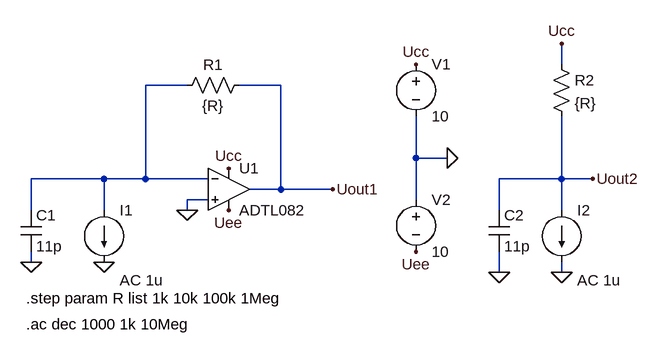
[diagram p0: schematic Zadanie2.asc]
Zadanie2.asc, the LTspice schematic file:
Version 4.1
SHEET 1 880 680
WIRE 416 -32 416 -64
WIRE -160 0 -224 0
WIRE -16 0 -80 0
WIRE 192 112 192 48
WIRE 240 112 192 112
WIRE -288 144 -400 144
WIRE -224 144 -224 0
WIRE -224 144 -288 144
WIRE -128 144 -224 144
WIRE 416 144 416 48
WIRE 416 144 320 144
WIRE 464 144 416 144
WIRE -16 160 -16 0
WIRE -16 160 -64 160
WIRE 64 160 -16 160
WIRE -128 176 -160 176
WIRE 192 176 192 112
WIRE -400 192 -400 144
WIRE -288 192 -288 144
WIRE -160 192 -160 176
WIRE 320 192 320 144
WIRE 416 192 416 144
WIRE -400 272 -400 256
WIRE 320 288 320 256
WIRE 416 288 416 272
FLAG -96 192 Uee
FLAG -96 128 Ucc
FLAG 64 160 Uout1
FLAG -160 192 0
FLAG -288 272 0
FLAG -400 272 0
FLAG 192 -32 Ucc
FLAG 192 256 Uee
FLAG 240 112 0
FLAG 320 288 0
FLAG 416 288 0
FLAG 416 -64 Ucc
FLAG 464 144 Uout2
SYMBOL OpAmps\\ADTL082 -96 96 R0
SYMATTR InstName U1
SYMBOL res -64 -16 R90
WINDOW 0 0 56 VBottom 2
WINDOW 3 32 56 VTop 2
SYMATTR InstName R1
SYMATTR Value {R}
SYMBOL current -288 192 R0
WINDOW 123 24 108 Left 2
WINDOW 39 0 0 Left 0
SYMATTR Value2 AC 1u
SYMATTR InstName I1
SYMATTR Value ""
SYMBOL cap -416 192 R0
SYMATTR InstName C1
SYMATTR Value 11p
SYMBOL voltage 192 -48 R0
WINDOW 123 0 0 Left 0
WINDOW 39 0 0 Left 0
SYMATTR InstName V1
SYMATTR Value 10
SYMBOL voltage 192 160 R0
WINDOW 123 0 0 Left 0
WINDOW 39 0 0 Left 0
SYMATTR InstName V2
SYMATTR Value 10
SYMBOL res 400 -48 R0
SYMATTR InstName R2
SYMATTR Value {R}
SYMBOL cap 304 192 R0
SYMATTR InstName C2
SYMATTR Value 11p
SYMBOL current 416 192 R0
WINDOW 123 24 108 Left 2
WINDOW 39 0 0 Left 0
SYMATTR Value2 AC 1u
SYMATTR InstName I2
SYMATTR Value ""
TEXT -408 328 Left 2 !.step param R list 1k 10k 100k 1Meg
TEXT -408 368 Left 2 !.ac dec 1000 1k 10Meg

The netlist it stands for:
* Zadanie2.asc
X§U1 0 N001 Ucc Uee Uout1 ADTL082  ; pins In+ In- V+ V- OUT
R1 Uout1 N001 {R}
I1 N001 0 AC 1u
C1 N001 0 11p
V1 Ucc 0 10
V2 0 Uee 10
R2 Ucc Uout2 {R}
C2 Uout2 0 11p
I2 Uout2 0 AC 1u
.step param R list 1k 10k 100k 1Meg
.ac dec 1000 1k 10Meg
.lib ADI.lib
.backanno
.end